# Altium schematic sheet CONNECTOR_EXP.SchDoc
size 420 x 297 mm; SheetNumber: 7; SheetTotal: 32
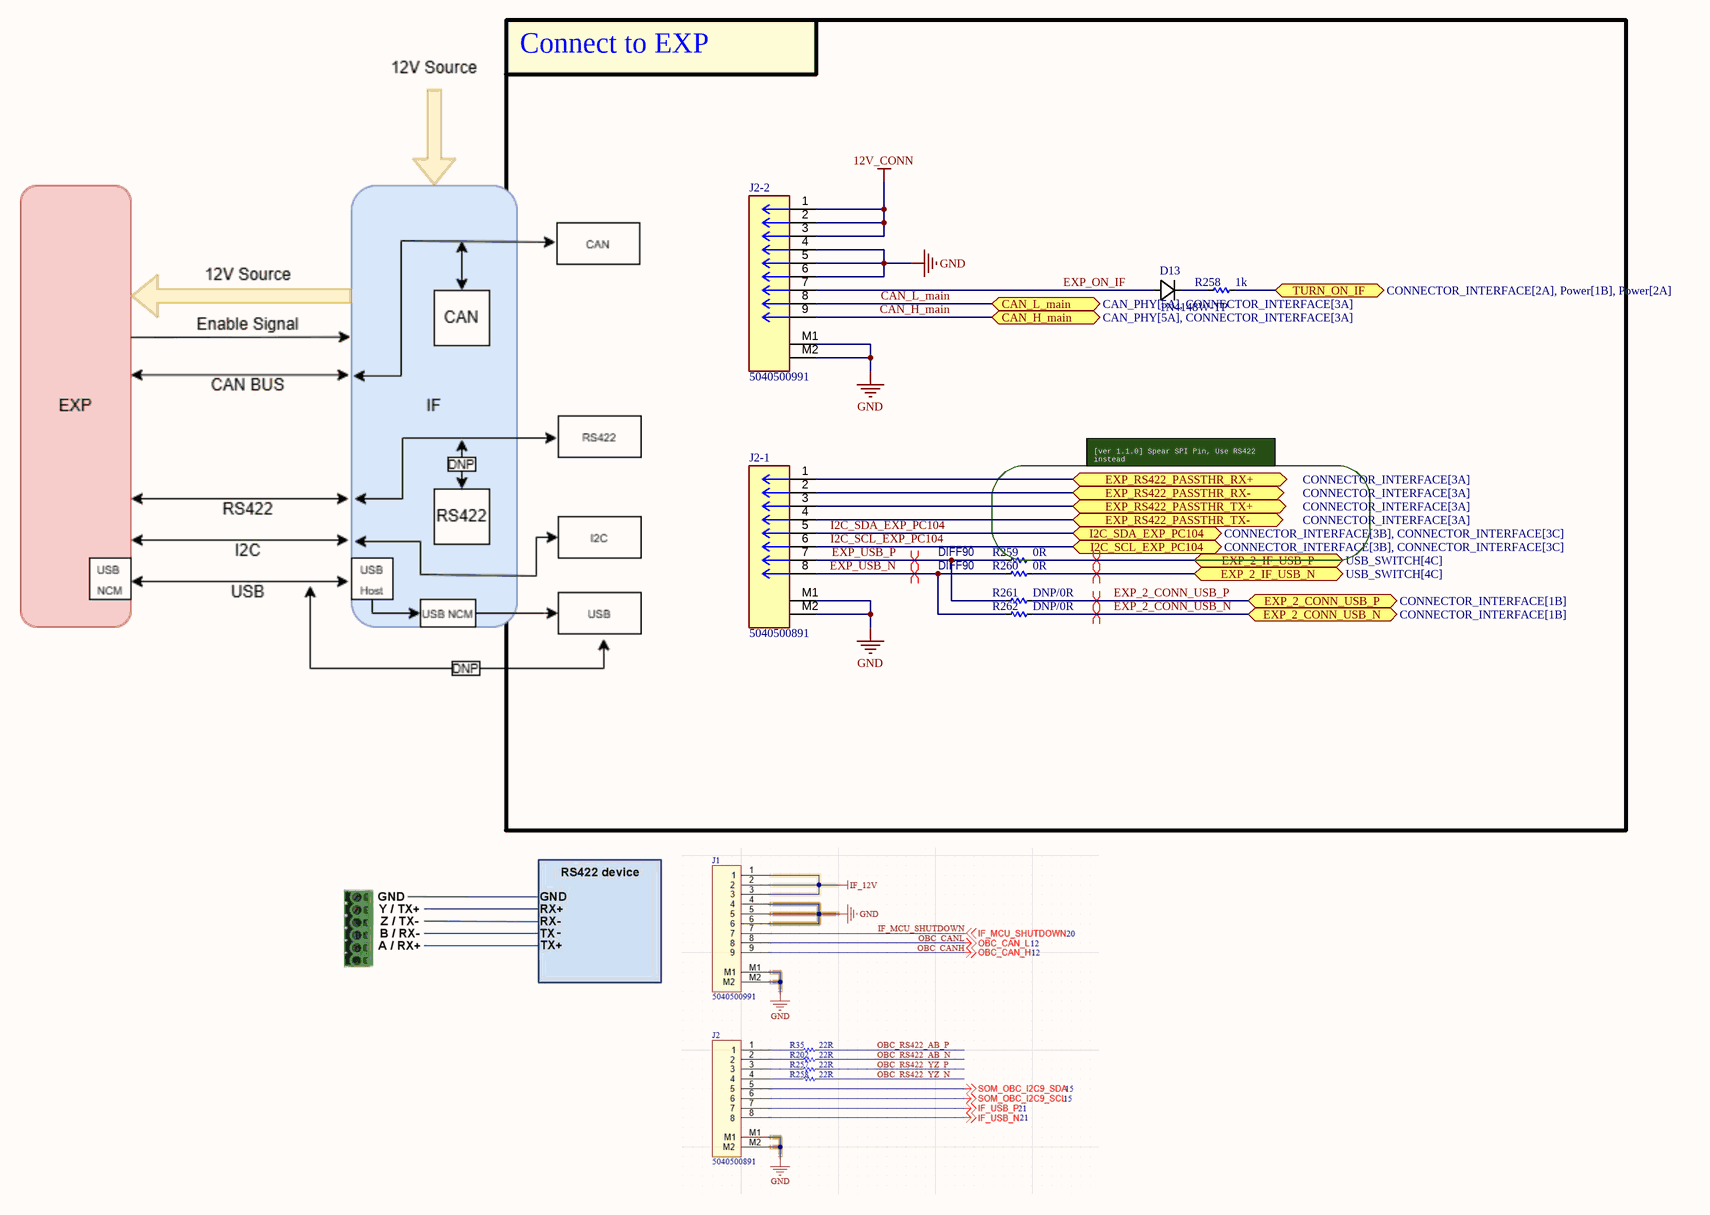
[diagram p0: CONNECTOR_EXP.SchDoc]

## Parts
D13  1N4148W-TP  [SOD123_MCC]
J2-1  5040500891  [MOLEX_5040500891]
J2-2  5040500991  [MOLEX_5040500991]
R258  1k  [RES_C_1005x30_L]
R259  0R  [RES_C_1005x30_L]
R260  0R  [RES_C_1005x30_L]
R261  DNP/0R  [RES_C_1005x30_L]
R262  DNP/0R  [RES_C_1005x30_L]

## Blocks framed on the sheet
Connect to EXP: D13 J2-1 J2-2 R258-R262

## Ports
CAN_H_main (bidir, see CAN_PHY[5A], CONNECTOR_INTERFACE[3A]), CAN_L_main (bidir, see CAN_PHY[5A], CONNECTOR_INTERFACE[3A]), EXP_2_CONN_USB_N (bidir, see CONNECTOR_INTERFACE[1B]), EXP_2_CONN_USB_P (bidir, see CONNECTOR_INTERFACE[1B]), EXP_2_IF_USB_N (bidir, see USB_SWITCH[4C]), EXP_2_IF_USB_P (bidir, see USB_SWITCH[4C]), EXP_RS422_PASSTHR_RX+ (bidir, see CONNECTOR_INTERFACE[3A]), EXP_RS422_PASSTHR_RX- (bidir, see CONNECTOR_INTERFACE[3A]), EXP_RS422_PASSTHR_TX+ (bidir, see CONNECTOR_INTERFACE[3A]), EXP_RS422_PASSTHR_TX- (bidir, see CONNECTOR_INTERFACE[3A]), I2C_SCL_EXP_PC104 (bidir, see CONNECTOR_INTERFACE[3B], CONNECTOR_INTERFACE[3C]), I2C_SDA_EXP_PC104 (bidir, see CONNECTOR_INTERFACE[3B], CONNECTOR_INTERFACE[3C]), TURN_ON_IF (bidir, see CONNECTOR_INTERFACE[2A], Power[1B], Power[2A])

## Nets
12V_CONN: J2-2.1 J2-2.2 J2-2.3
GND: J2-1.M1 J2-1.M2 J2-2.4 J2-2.5 J2-2.6 J2-2.M1 J2-2.M2
CAN_H_main: J2-2.9 ; port CAN_H_main
CAN_L_main: J2-2.8 ; port CAN_L_main
EXP_2_CONN_USB_N: R262.2 ; port EXP_2_CONN_USB_N
EXP_2_CONN_USB_P: R261.2 ; port EXP_2_CONN_USB_P
EXP_2_IF_USB_N: R260.2 ; port EXP_2_IF_USB_N
EXP_2_IF_USB_P: R259.2 ; port EXP_2_IF_USB_P
EXP_ON_IF: D13.2 J2-2.7
EXP_RS422_PASSTHR_RX+: J2-1.1 ; port EXP_RS422_PASSTHR_RX+
EXP_RS422_PASSTHR_RX-: J2-1.2 ; port EXP_RS422_PASSTHR_RX-
EXP_RS422_PASSTHR_TX+: J2-1.3 ; port EXP_RS422_PASSTHR_TX+
EXP_RS422_PASSTHR_TX-: J2-1.4 ; port EXP_RS422_PASSTHR_TX-
EXP_USB_N: J2-1.8 R260.1 R262.1
EXP_USB_P: J2-1.7 R259.1 R261.1
I2C_SCL_EXP_PC104: J2-1.6 ; port I2C_SCL_EXP_PC104
I2C_SDA_EXP_PC104: J2-1.5 ; port I2C_SDA_EXP_PC104
TURN_ON_IF: R258.2 ; port TURN_ON_IF
NetD13_1: D13.1 R258.1

## Layout directives
differential pair; differential pair class DIFF90; net class DIFF90; rule Matched Net Lengths [Tolerance = 4mil]: EXP_2_CONN_USB_N, EXP_2_CONN_USB_P, EXP_2_IF_USB_N, EXP_2_IF_USB_P, EXP_USB_N, EXP_USB_P

## Notes on the sheet
- [ver 1.1.0] Spear SPI Pin, Use RS422 instead
- Project:
- Sub-system:
- Design by:
- Sheet title:
- Sheet
- A3
- of
- Checked by:
- Approved by:
- Revision:
- Document No:
- Size:
- Date:

## Library data of the parts
D13 = 1N4148W-TP: Description; Manufacturer_Name: MCC; Copyright: Copyright (C) 2026 Ultra Librarian. All rights reserved.; Manufacturer_Part_Number: 1N4148W-TP
J2-1 = 5040500891: Connector Header Surface Mount, Right Angle 8 position 0.059" (1.50mm)`
J2-2 = 5040500991: Connector Header Surface Mount, Right Angle 9 position 0.059" (1.50mm)
R258-R262 = _RES_B_2: RES